# Altium schematic sheet InverterBoard.SchDoc
size A
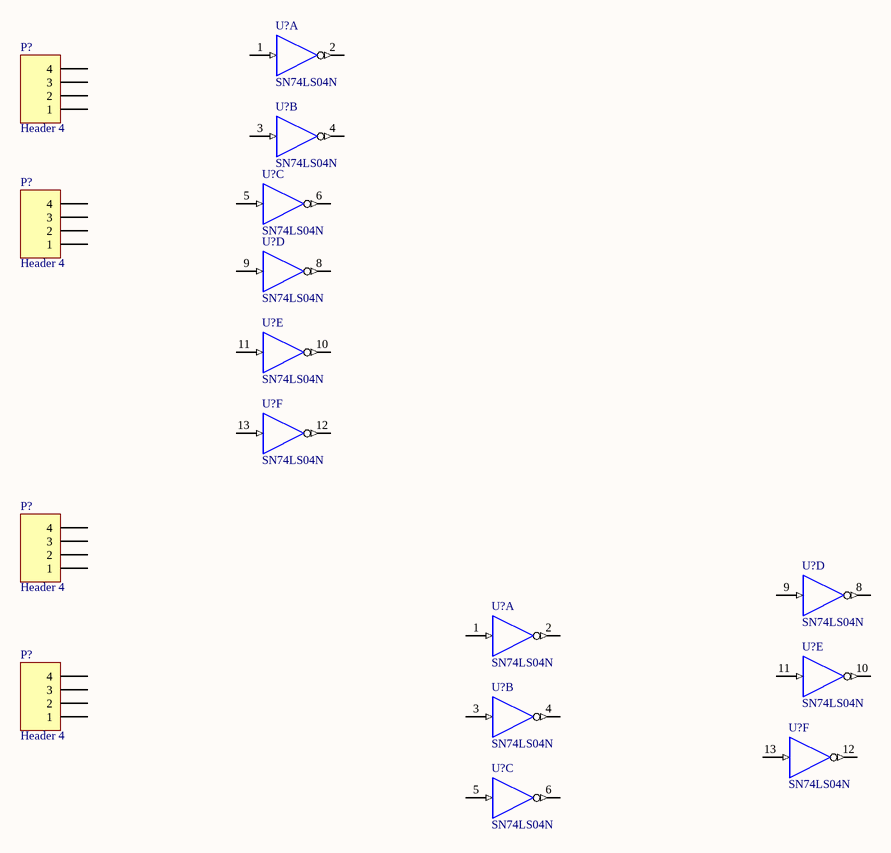
[diagram p0: InverterBoard.SchDoc]

## Parts
(Parts that share a designator on the sheet are numbered #1, #2 ... from top to bottom, then left to right.)
P?#1  Header 4  [HDR1X4]
P?#2  Header 4  [HDR1X4]
P?#3  Header 4  [HDR1X4]
P?#4  Header 4  [HDR1X4]
U?#1  SN74LS04N  [N014]  (part A of 6)
U?#2  SN74LS04N  [N014]  (part B of 6)
U?#3  SN74LS04N  [N014]  (part C of 6)
U?#4  SN74LS04N  [N014]  (part D of 6)
U?#5  SN74LS04N  [N014]  (part E of 6)
U?#6  SN74LS04N  [N014]  (part F of 6)
U?#7  SN74LS04N  [N014]  (part D of 6)
U?#8  SN74LS04N  [N014]  (part A of 6)
U?#9  SN74LS04N  [N014]  (part E of 6)
U?#10  SN74LS04N  [N014]  (part B of 6)
U?#11  SN74LS04N  [N014]  (part F of 6)
U?#12  SN74LS04N  [N014]  (part C of 6)

## Nets
GND: U?#1.7(GND) U?#2.7(GND) U?#3.7(GND) U?#4.7(GND) U?#5.7(GND) U?#6.7(GND) U?#7.7(GND) U?#8.7(GND) U?#9.7(GND) U?#10.7(GND) U?#11.7(GND) U?#12.7(GND)
VCC: U?#1.14(VCC) U?#2.14(VCC) U?#3.14(VCC) U?#4.14(VCC) U?#5.14(VCC) U?#6.14(VCC) U?#7.14(VCC) U?#8.14(VCC) U?#9.14(VCC) U?#10.14(VCC) U?#11.14(VCC) U?#12.14(VCC)

Not connected (* = marked no-connect by the designer): P?#1 1 2 3 4; P?#2 1 2 3 4; P?#3 1 2 3 4; P?#4 1 2 3 4; U?#1 1(A) 2(Y); U?#2 3(A) 4(Y); U?#3 5(A) 6(Y); U?#4 8(Y) 9(A); U?#5 10(Y) 11(A); U?#6 12(Y) 13(A); U?#7 8(Y) 9(A); U?#8 1(A) 2(Y); U?#9 10(Y) 11(A); U?#10 3(A) 4(Y); U?#11 12(Y) 13(A); U?#12 5(A) 6(Y)

## Library data of the parts
P?#1-P?#4 = Header 4: Header, 4-Pin; LatestRevisionDate: 17-Jul-2002; LatestRevisionNote: Re-released for DXP Platform.; Publisher: Altium Limited
U?#1-U?#12 = SN74LS04N: Hex Inverter; Published: 8-Jun-2000; LatestRevisionDate: 04-Mar-2005; LatestRevisionNote: Stylized 3D Model Added.; DatasheetVersion: Mar-1988; PackageVersion: Oct-1995; PackageReference: N014; Publisher: Altium Limited; PackageDescription: DIP; 14 Leads; Row Spacing 7.62 mm; Pitch 2.54 mm; ComponentLink1Description: Manufacturer Link; ComponentLink1URL: http://www.ti.com/; ComponentLink2Description: Datasheet; ComponentLink2URL: http://www-s.ti.com/sc/ds/sn74ls04.pdf